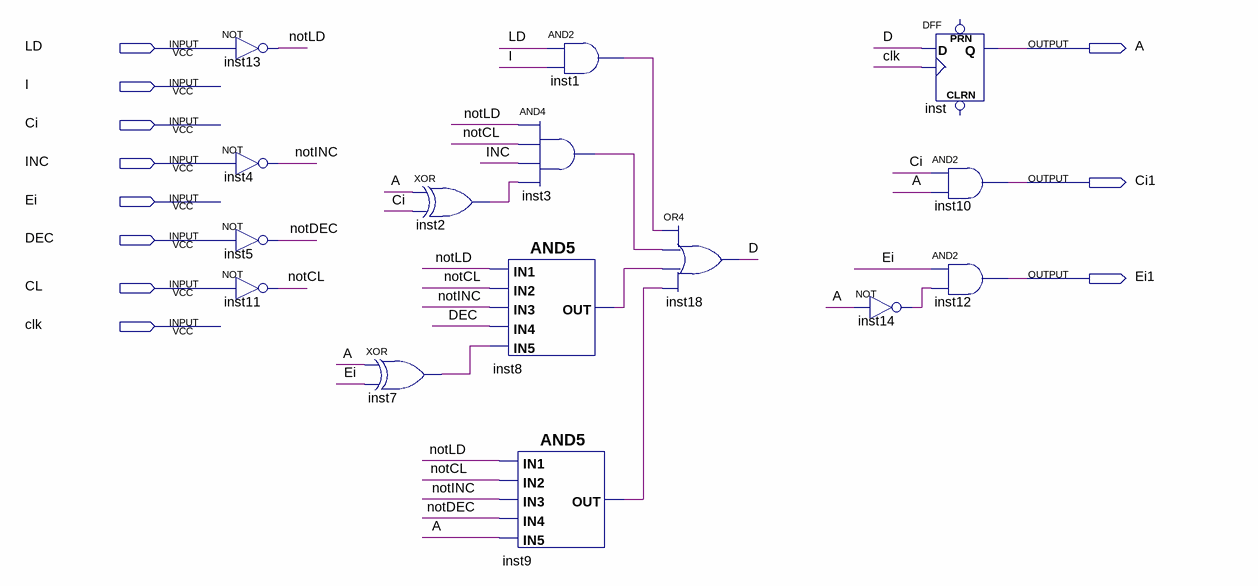
[diagram p0: schematic sheet]
// Quartus schematic REG1_LD_CL_INC_DEC.bdf as structural Verilog: 15 symbols, 11 pins
module REG1_LD_CL_INC_DEC (
  input  LD,
  input  I,
  input  Ci,
  input  INC,
  input  Ei,
  input  DEC,
  input  CL,
  input  clk,
  output A,
  output Ci1,
  output Ei1
);

  wire D, inst1_out, inst2_out, inst3_out, inst7_out, inst8_out, inst9_out, inst14_out, notCL, notDEC,
       notINC, notLD;

  not inst13 (notLD, LD);
  not inst4 (notINC, INC);
  not inst5 (notDEC, DEC);
  not inst11 (notCL, CL);
  xor inst7 (inst7_out, A, Ei);
  xor inst2 (inst2_out, A, Ci);
  and inst1 (inst1_out, LD, I);
  and inst3 (inst3_out, notLD, notCL, INC, inst2_out);
  and inst8 (inst8_out, notLD, notCL, notINC, DEC, inst7_out);
  and inst9 (inst9_out, notLD, notCL, notINC, notDEC, A);
  or inst18 (D, inst1_out, inst3_out, inst8_out, inst9_out);
  not inst14 (inst14_out, A);
  DFF inst (.CLK(clk), .D(D), .Q(A));  // open: CLRN, PRN
  and inst10 (Ci1, Ci, A);
  and inst12 (Ei1, Ei, inst14_out);
endmodule
